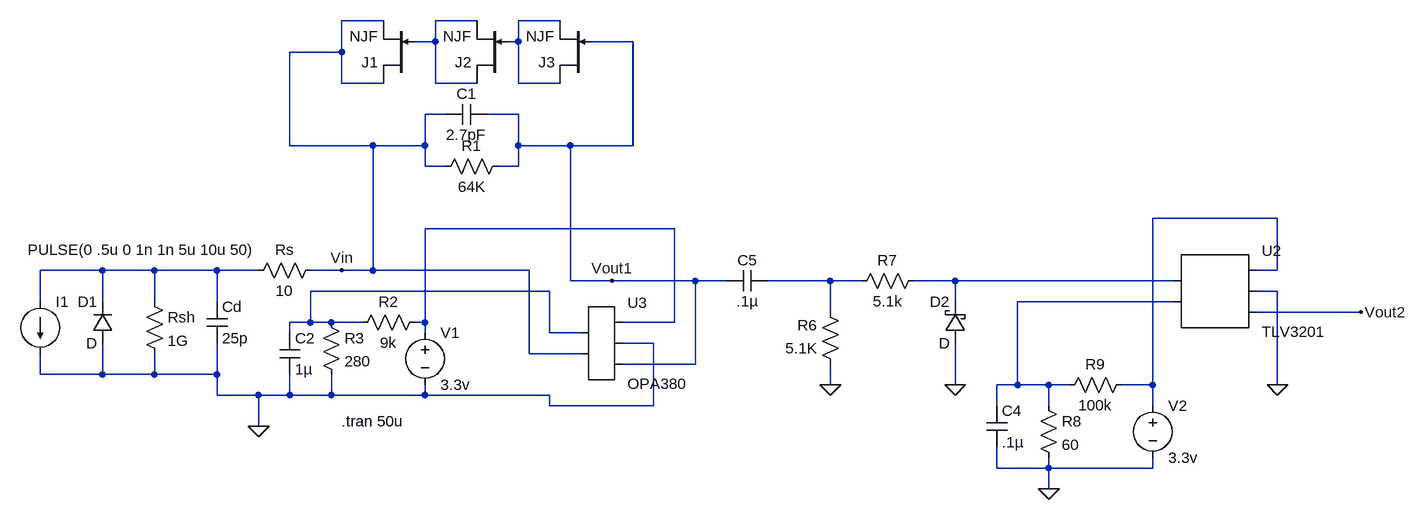
[diagram p0: schematic OPA 380 with comparator.asc]
OPA 380 with comparator.asc, the LTspice schematic file:
Version 4
SHEET 1 1744 680
WIRE 160 -128 96 -128
WIRE 304 -128 240 -128
WIRE 432 -128 368 -128
WIRE 240 -96 240 -128
WIRE 240 -96 208 -96
WIRE 368 -96 368 -128
WIRE 368 -96 352 -96
WIRE 544 -96 480 -96
WIRE 96 -80 96 -128
WIRE 96 -80 16 -80
WIRE 96 -32 96 -80
WIRE 160 -32 96 -32
WIRE 240 -32 240 -96
WIRE 304 -32 240 -32
WIRE 368 -32 368 -96
WIRE 432 -32 368 -32
WIRE 256 16 224 16
WIRE 368 16 320 16
WIRE 16 64 16 -80
WIRE 144 64 16 64
WIRE 224 64 224 16
WIRE 224 64 144 64
WIRE 368 64 368 16
WIRE 448 64 368 64
WIRE 544 64 544 -96
WIRE 544 64 448 64
WIRE 224 96 224 64
WIRE 256 96 224 96
WIRE 368 96 368 64
WIRE 368 96 336 96
WIRE 1536 176 1344 176
WIRE 608 192 224 192
WIRE -272 256 -368 256
WIRE -192 256 -272 256
WIRE -96 256 -192 256
WIRE -32 256 -96 256
WIRE 96 256 48 256
WIRE 144 256 144 64
WIRE 144 256 96 256
WIRE 384 256 144 256
WIRE 1536 256 1536 176
WIRE 1536 256 1504 256
WIRE 448 272 448 64
WIRE 512 272 448 272
WIRE 640 272 512 272
WIRE 688 272 640 272
WIRE 848 272 752 272
WIRE 896 272 848 272
WIRE 1040 272 976 272
WIRE 1376 272 1040 272
WIRE 416 288 48 288
WIRE 1536 288 1504 288
WIRE -368 304 -368 256
WIRE -272 304 -272 256
WIRE -192 304 -192 256
WIRE -96 304 -96 256
WIRE 1040 304 1040 272
WIRE 1376 304 1136 304
WIRE 848 320 848 272
WIRE 1664 320 1504 320
WIRE 48 336 48 288
WIRE 48 336 16 336
WIRE 80 336 48 336
WIRE 128 336 80 336
WIRE 224 336 224 192
WIRE 224 336 208 336
WIRE 608 336 608 192
WIRE 608 336 528 336
WIRE 16 352 16 336
WIRE 224 352 224 336
WIRE 416 352 416 288
WIRE 464 352 416 352
WIRE 576 368 528 368
WIRE 384 384 384 256
WIRE 464 384 384 384
WIRE 640 400 640 272
WIRE 640 400 528 400
WIRE -368 416 -368 384
WIRE -272 416 -272 368
WIRE -272 416 -368 416
WIRE -192 416 -192 384
WIRE -192 416 -272 416
WIRE -96 416 -96 368
WIRE -96 416 -192 416
WIRE 848 432 848 400
WIRE 1040 432 1040 368
WIRE 1136 432 1136 304
WIRE 1136 432 1104 432
WIRE 1184 432 1136 432
WIRE 1216 432 1184 432
WIRE 1344 432 1344 176
WIRE 1344 432 1296 432
WIRE 1536 432 1536 288
WIRE -96 448 -96 416
WIRE -32 448 -96 448
WIRE 16 448 16 416
WIRE 16 448 -32 448
WIRE 80 448 80 416
WIRE 80 448 16 448
WIRE 224 448 224 432
WIRE 224 448 80 448
WIRE 416 448 224 448
WIRE 416 464 416 448
WIRE 576 464 576 368
WIRE 576 464 416 464
WIRE 1104 464 1104 432
WIRE 1184 464 1184 432
WIRE 1344 464 1344 432
WIRE -32 496 -32 448
WIRE 1104 560 1104 528
WIRE 1184 560 1184 544
WIRE 1184 560 1104 560
WIRE 1344 560 1344 544
WIRE 1344 560 1184 560
WIRE 1184 592 1184 560
FLAG 512 272 Vout1
FLAG 96 256 Vin
FLAG -32 496 0
FLAG 848 432 0
FLAG 1536 432 0
FLAG 1184 592 0
FLAG 1040 432 0
FLAG 1664 320 Vout2
SYMBOL res -208 288 R0
SYMATTR InstName Rsh
SYMATTR Value 1G
SYMBOL cap -112 304 R0
SYMATTR InstName Cd
SYMATTR Value 25p
SYMBOL res 64 240 R90
WINDOW 0 0 56 VBottom 2
WINDOW 3 32 56 VTop 2
SYMATTR InstName Rs
SYMATTR Value 10
SYMBOL current -368 304 R0
WINDOW 3 -19 -80 Left 2
SYMATTR Value PULSE(0 .5u 0 1n 1n 5u 10u 50)
SYMATTR InstName I1
SYMATTR Value2 AC 0 0
SYMBOL diode -256 368 R180
WINDOW 0 24 64 Left 2
WINDOW 3 24 0 Left 2
SYMATTR InstName D1
SYMBOL Res 64 320 R0
SYMATTR InstName R3
SYMATTR Value 280
SYMBOL Res 224 320 R90
WINDOW 0 0 56 VBottom 2
WINDOW 3 32 56 VTop 2
SYMATTR InstName R2
SYMATTR Value 9k
SYMBOL Cap 0 352 R0
SYMATTR InstName C2
SYMATTR Value 1µ
SYMBOL voltage 224 336 R0
SYMATTR InstName V1
SYMATTR Value 3.3v
SYMBOL Res 352 80 R90
WINDOW 0 0 56 VBottom 2
WINDOW 3 32 56 VTop 2
SYMATTR InstName R1
SYMATTR Value 64K
SYMBOL Cap 320 0 R90
WINDOW 0 0 32 VBottom 2
WINDOW 3 32 32 VTop 2
SYMATTR InstName C1
SYMATTR Value 2.7pF
SYMBOL njf 208 -32 R180
SYMATTR InstName J1
SYMBOL njf 352 -32 R180
SYMATTR InstName J2
SYMBOL njf 480 -32 R180
SYMATTR InstName J3
SYMBOL Res 864 416 R180
WINDOW 0 36 76 Left 2
WINDOW 3 36 40 Left 2
SYMATTR InstName R6
SYMATTR Value 5.1K
SYMBOL Res 992 256 R90
WINDOW 0 0 56 VBottom 2
WINDOW 3 32 56 VTop 2
SYMATTR InstName R7
SYMATTR Value 5.1k
SYMBOL schottky 1056 368 R180
WINDOW 0 24 64 Left 2
WINDOW 3 24 0 Left 2
SYMATTR InstName D2
SYMBOL AutoGenerated/TLV3201 1440 288 R0
SYMATTR InstName U2
SYMBOL Cap 1088 464 R0
SYMATTR InstName C4
SYMATTR Value .1µ
SYMBOL Res 1168 448 R0
SYMATTR InstName R8
SYMATTR Value 60
SYMBOL Voltage 1344 448 R0
SYMATTR InstName V2
SYMATTR Value 3.3v
SYMBOL Res 1312 416 R90
WINDOW 0 0 56 VBottom 2
WINDOW 3 32 56 VTop 2
SYMATTR InstName R9
SYMATTR Value 100k
SYMBOL Cap 752 256 R90
WINDOW 0 0 32 VBottom 2
WINDOW 3 32 32 VTop 2
SYMATTR InstName C5
SYMATTR Value .1µ
SYMBOL AutoGenerated/OPA380 496 368 R0
SYMATTR InstName U3
TEXT 96 488 Left 2 !.tran 50u

The netlist it stands for:
* OPA 380 with comparator.asc
Rsh N005 0 1G
Cd N005 0 25p
Rs Vin N005 10
I1 N005 0 PULSE(0 .5u 0 1n 1n 5u 10u 50) AC 0 0
D1 0 N005 D
R3 N008 0 280
R2 N004 N008 9k
C2 N008 0 1µ
V1 N004 0 3.3v
R1 Vout1 Vin 64K
C1 Vout1 Vin 2.7pF
J1 Vin N001 Vin NJF
J2 N001 N002 N001 NJF
J3 N002 Vout1 N002 NJF
R6 0 N006 5.1K
R7 N007 N006 5.1k
D2 0 N007 D
* U2: TLV3201 (symbol AutoGenerated/TLV3201 not available, pins judged from their places): pin1=N007 pin2=N009 pin3=N003 pin4=0 pin5=Vout2
C4 N009 0 .1µ
R8 N009 0 60
V2 N003 0 3.3v
R9 N003 N009 100k
C5 N006 Vout1 .1µ
* U3: OPA380 (symbol AutoGenerated/OPA380 not available, pins judged from their places): pin1=N008 pin2=Vin pin3=N004 pin4=0 pin5=Vout1
.model D D
.lib standard.dio
.model NJF NJF
.model PJF PJF
.lib standard.jft
.tran 50u
.backanno
.end